# Altium project CLASS1.PrjPCB
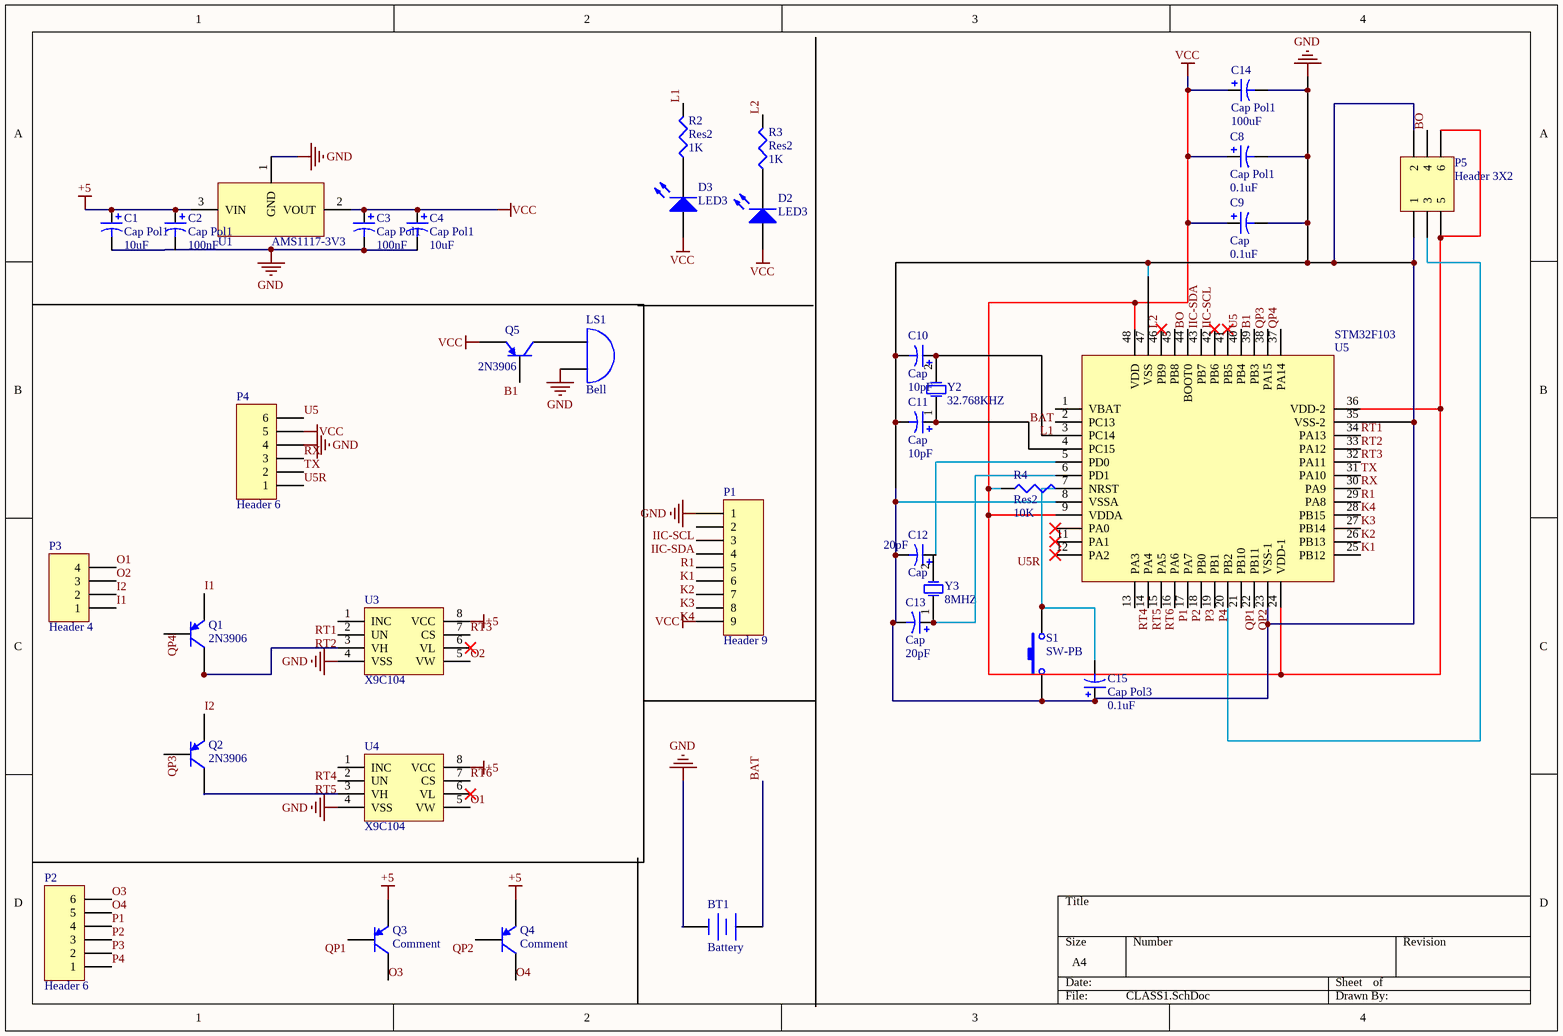
[diagram p0: CLASS1.SchDoc]
1 sheet, 36 parts. Net scope: global (net labels, ports and power ports of the same name join across sheets).
Board file: CLASS1.PcbDoc

## Sheet CLASS1.SchDoc
size A4

### Parts
BT1  Battery  [BAT-2]
C1  Cap Pol1  value 10uF  [C0805]
C2  Cap Pol1  value 100nF  [C0805]
C3  Cap Pol1  value 100nF  [C0805]
C4  Cap Pol1  value 10uF  [C0805]
C8  Cap Pol1  value 0.1uF  [C0805]
C9  Cap  value 0.1uF  [C0805]
C10  Cap  value 10pF  [C0805]
C11  Cap  value 10pF  [C0805]
C12  Cap  value 20pF  [C0805]
C13  Cap  value 20pF  [C0805]
C14  Cap Pol1  value 100uF  [A]
C15  Cap Pol3  value 0.1uF  [C0805]
D2  LED3  [6-0805]
D3  LED3  [C0805]
LS1  Bell  [PIN2]
P1  Header 9  [HDR1X9]
P2  Header 6  [HDR1X6]
P3  Header 4  [HDR1X4]
P4  Header 6  [HDR1X6]
P5  Header 3X2  [HDR2X3]
Q1  2N3906  [TO-92A]
Q2  2N3906  [TO-92A]
Q3  Comment  [TO-92A]
Q4  Comment  [TO-92A]
Q5  2N3906  [TO-92A]
R2  Res2  value 1K  [J1-0603]
R3  Res2  value 1K  [J1-0603]
R4  Res2  value 10K  [J1-0603]
S1  SW-PB  [SPST-2]
U1  AMS1117-3V3  [AMS1117-3V3]
U3  X9C104  [X9C104]
U4  X9C104  [X9C104]
U5  STM32F103  [STM32F103]
Y2  32.768KHZ  [R38]
Y3  8MHZ  [R38]

### Nets
+5: C1.1 C2.1 Q3.1(E) Q4.1(E) U1.3(VIN) U3.8(VCC) U4.8(VCC)
GND: BT1.2(-) C1.2 C3.2 C4.2 C8.2 C9.2 C10.2 C11.2 C12.2 C13.2 C14.2 C15.1 LS1.2(B) P1.1 P4.4 P5.1 P5.2 S1.2 U1.1(GND) U3.4(VSS) U4.4(VSS) U5.8(VSSA) U5.23(VSS-1) U5.35(VSS-2) U5.47(VSS)
VCC: C3.1 C4.1 C8.1 C9.1 C14.1 D2.1(A) D3.1(A) P1.9 P4.5 P5.5 P5.6 Q5.1(E) R4.1 U1.2(VOUT) U5.9(VDDA) U5.24(VDD-1) U5.36(VDD-2) U5.48(VDD)
B1: Q5.2(B) U5.39(PB3)
BAT: BT1.1(+) U5.1(VBAT)
BO: P5.4 U5.44(BOOT0)
I1: P3.1 Q1.1(E)
I2: P3.2 Q2.1(E)
IIC-SCL: P1.2 U5.42(PB6)
IIC-SDA: P1.3 U5.43(PB7)
K1: P1.5 U5.25(PB12)
K2: P1.6 U5.26(PB13)
K3: P1.7 U5.27(PB14)
K4: P1.8 U5.28(PB15)
L1: R2.2 U5.2(PC13)
L2: R3.2 U5.46(PB9)
O1: P3.4 U4.5(VW)
O2: P3.3 U3.5(VW)
O3: P2.6 Q3.3(C)
O4: P2.5 Q4.3(C)
P1: P2.4 U5.16(PA6)
P2: P2.3 U5.17(PA7)
P3: P2.2 U5.18(PB0)
P4: P2.1 U5.19(PB1)
QP1: Q3.2(B) U5.21(PB10)
QP2: Q4.2(B) U5.22(PB11)
QP3: Q2.2(B) U5.38(PA15)
QP4: Q1.2(B) U5.37(PA14)
R1: P1.4 U5.29(PA8)
RT1: U3.1(INC) U5.34(PA13)
RT2: U3.2(UN) U5.33(PA12)
RT3: U3.7(CS) U5.32(PA11)
RT4: U4.1(INC) U5.13(PA3)
RT5: U4.2(UN) U5.14(PA4)
RT6: U4.7(CS) U5.15(PA5)
RX: P4.3 U5.30(PA9)
TX: P4.2 U5.31(PA10)
U5: P4.6 U5.40(PB4)
U5R: C15.2 P4.1 S1.1 U5.7(NRST)
NetC10_1: C10.1 U5.3(PC14) Y2.2(OSC2)
NetC11_1: C11.1 U5.4(PC15) Y2.1(OSC1)
NetC12_1: C12.1 U5.5(PD0)
NetC13_1: C13.1 U5.6(PD1) Y3.1(OSC1)
NetD2_2: D2.2(K) R3.1
NetD3_2: D3.2(K) R2.1
NetLS1_1: LS1.1(A) Q5.3(C)
NetP5_3: P5.3 U5.20(PB2)
NetQ1_3: Q1.3(C) U3.3(VH)
NetQ2_3: Q2.3(C) U4.3(VH)

Not connected (* = marked no-connect by the designer): C2 2; R4 2; U3 6(VL)*; U4 6(VL)*; U5 10(PA0)* 11(PA1)* 12(PA2)* 41(PB5)* 45(PB8); Y3 2(OSC2)

### Library data of the parts
BT1 = Battery: Multicell Battery; Published: 24-Mar-1999; LatestRevisionDate: 17-Jul-2002; LatestRevisionNote: Re-released for DXP Platform.; PackageReference: BAT-2; Publisher: Altium Limited
C1-C4 C8-C13 C15 = Cap Pol3: Polarized Capacitor (Surface Mount); Published: 8-Jun-2000; LatestRevisionDate: 17-Jul-2002; LatestRevisionNote: Re-released for DXP Platform.; PackageReference: C0805; Publisher: Altium Limited
C14 = Cap Pol1: Polarized Capacitor (Radial); Published: 8-Jun-2000; LatestRevisionDate: 17-Jul-2002; LatestRevisionNote: Re-released for DXP Platform.; PackageReference: RB7.6-15; Publisher: Altium Limited
D2 D3 = LED3: Typical BLUE SiC LED; Published: 8-Jun-2000; LatestRevisionDate: 17-Dec-2003; LatestRevisionNote: PCB Footprint replaced.; DatasheetDocument: 16-Apr-2002; PackageDocument: 16-Apr-2002; PackageReference: 3.5X2.8X1.9; Publisher: Altium Limited
LS1 = Bell: Electrical Bell; Published: 24-Mar-1999; LatestRevisionDate: 17-Jul-2002; LatestRevisionNote: Re-released for DXP Platform.; PackageReference: PIN2; Publisher: Altium Limited
P1 = Header 9: Header, 9-Pin; LatestRevisionDate: 17-Jul-2002; LatestRevisionNote: Re-released for DXP Platform.; Publisher: Altium Limited
P2 P4 = Header 6: Header, 6-Pin; LatestRevisionDate: 17-Jul-2002; LatestRevisionNote: Re-released for DXP Platform.; Publisher: Altium Limited
P3 = Header 4: Header, 4-Pin; LatestRevisionDate: 17-Jul-2002; LatestRevisionNote: Re-released for DXP Platform.; Publisher: Altium Limited
P5 = Header 3X2: Header, 3-Pin, Dual row; LatestRevisionDate: 17-Jul-2002; LatestRevisionNote: Re-released for DXP Platform.; Publisher: Altium Limited
Q1-Q5 = 2N3906: PNP General Purpose Amplifier; Published: 8-Jun-2000; LatestRevisionDate: 15-Jan-2003; LatestRevisionNote: PCB Footprint 'BCY-W3/D4.7' replaced; DatasheetDocument: 1997; PackageDocument: Sep-1998; PackageReference: TO-92A; Publisher: Altium Limited; Code_JEDEC: TO-92A; ComponentLink1Description: Manufacturer Link; ComponentLink1URL: http://www.fairchildsemi.com/; ComponentLink2Description: Datasheet; ComponentLink2URL: http://www.fairchildsemi.com/ds/2N%2F2N3906.pdf
R2-R4 = Res3: Resistor; Published: 8-Jun-2000; LatestRevisionDate: 04-Mar-2005; LatestRevisionNote: PCB Footprint replaced.; PackageReference: J1-0603; Publisher: Altium Limited
S1 = SW-PB: Switch; Published: 24-Mar-1999; LatestRevisionDate: 17-Jul-2002; LatestRevisionNote: Re-released for DXP Platform.; PackageReference: SPST-2; Publisher: Altium Limited
U3 U4 = xX9C104
Y2 Y3 = XTAL: Crystal Oscillator; Published: 8-Jun-2000; LatestRevisionDate: 17-Jul-2002; LatestRevisionNote: Re-released for DXP Platform.; PackageReference: R38; Publisher: Altium Limited